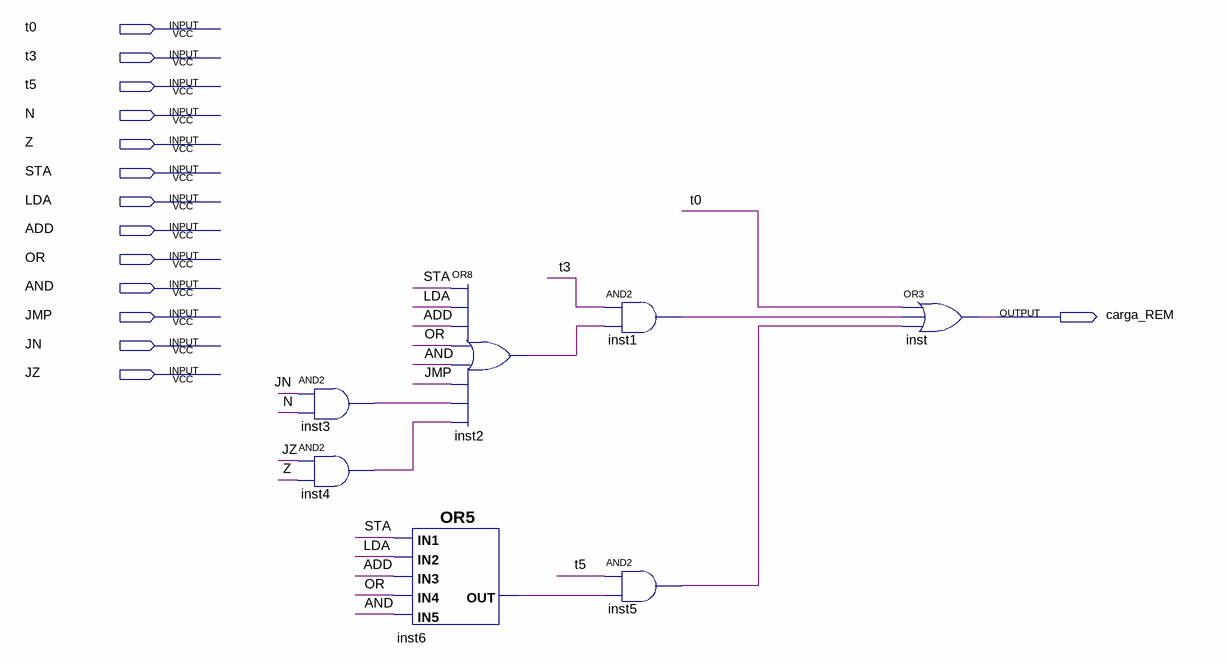
[diagram p0: schematic sheet]
// Quartus schematic carga_REM.bdf as structural Verilog: 7 symbols, 14 pins
module carga_REM (
  input  t0,
  input  t3,
  input  t5,
  input  N,
  input  Z,
  input  STA,
  input  LDA,
  input  ADD,
  input  OR,
  input  AND,
  input  JMP,
  input  JN,
  input  JZ,
  output carga_REM
);

  wire inst1_out, inst2_out, inst3_out, inst4_out, inst5_out, inst6_out;

  and inst3 (inst3_out, JN, N);
  and inst4 (inst4_out, JZ, Z);
  or inst2 (inst2_out, STA, LDA, ADD, OR, AND, JMP, inst3_out, inst4_out);
  or inst6 (inst6_out, STA, LDA, ADD, OR, AND);
  and inst1 (inst1_out, t3, inst2_out);
  and inst5 (inst5_out, t5, inst6_out);
  or inst (carga_REM, t0, inst1_out, inst5_out);
endmodule
